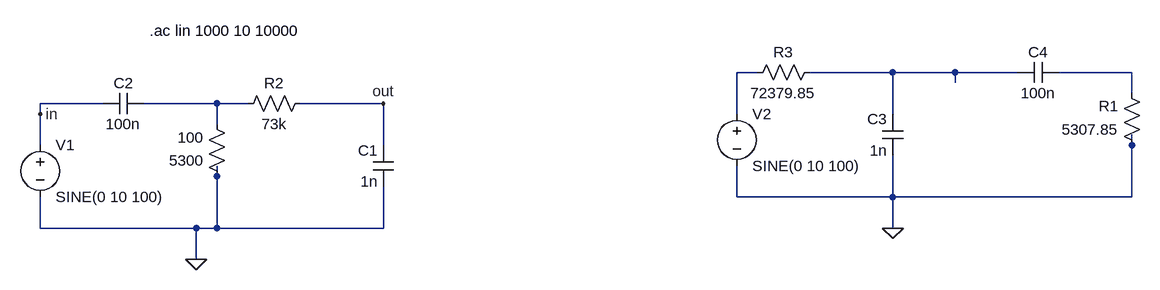
[diagram p0: schematic Passa-BandaRC.asc]
Passa-BandaRC.asc, the LTspice schematic file:
Version 4
SHEET 1 1508 680
WIRE 912 160 880 160
WIRE 1120 160 992 160
WIRE 1216 160 1120 160
WIRE 1312 160 1216 160
WIRE 1488 160 1376 160
WIRE 1216 176 1216 160
WIRE 1488 192 1488 160
WIRE -96 208 -192 208
WIRE 80 208 -32 208
WIRE 128 208 80 208
WIRE 336 208 208 208
WIRE -192 224 -192 208
WIRE 880 224 880 160
WIRE 1120 224 1120 160
WIRE 80 240 80 208
WIRE -192 272 -192 224
WIRE 336 272 336 208
WIRE 1488 272 1488 256
WIRE 80 320 80 304
WIRE 880 352 880 304
WIRE 1120 352 1120 288
WIRE 1120 352 880 352
WIRE 1488 352 1488 272
WIRE 1488 352 1120 352
WIRE -192 400 -192 352
WIRE 48 400 -192 400
WIRE 80 400 80 320
WIRE 80 400 48 400
WIRE 336 400 336 336
WIRE 336 400 80 400
WIRE 1120 400 1120 352
WIRE 48 448 48 400
FLAG 48 448 0
FLAG 336 208 out
FLAG -192 224 in
FLAG 1120 400 0
SYMBOL res 96 336 R180
WINDOW 0 36 76 Left 2
WINDOW 3 36 40 Left 2
SYMATTR InstName 100
SYMATTR Value 5300
SYMBOL res 112 224 R270
WINDOW 0 32 56 VTop 2
WINDOW 3 0 56 VBottom 2
SYMATTR InstName R2
SYMATTR Value 73k
SYMBOL cap 352 336 R180
WINDOW 0 24 56 Left 2
WINDOW 3 24 8 Left 2
SYMATTR InstName C1
SYMATTR Value 1n
SYMBOL cap -96 224 R270
WINDOW 0 32 32 VTop 2
WINDOW 3 0 32 VBottom 2
SYMATTR InstName C2
SYMATTR Value 100n
SYMBOL voltage -192 256 R0
SYMATTR InstName V1
SYMATTR Value SINE(0 10 100)
SYMATTR Value2 AC 10 0
SYMBOL res 1504 288 R180
WINDOW 0 36 76 Left 2
WINDOW 3 36 40 Left 2
SYMATTR InstName R1
SYMATTR Value 5307.85
SYMBOL res 896 176 R270
WINDOW 0 32 56 VTop 2
WINDOW 3 0 56 VBottom 2
SYMATTR InstName R3
SYMATTR Value 72379.85
SYMBOL cap 1136 288 R180
WINDOW 0 24 56 Left 2
WINDOW 3 24 8 Left 2
SYMATTR InstName C3
SYMATTR Value 1n
SYMBOL cap 1312 176 R270
WINDOW 0 32 32 VTop 2
WINDOW 3 0 32 VBottom 2
SYMATTR InstName C4
SYMATTR Value 100n
SYMBOL voltage 880 208 R0
SYMATTR InstName V2
SYMATTR Value SINE(0 10 100)
SYMATTR Value2 AC 10 0
TEXT -24 96 Left 2 !.ac lin 1000 10 10000

The netlist it stands for:
* Passa-BandaRC.asc
R§100 0 N004 5300
R2 N004 out 73k
C1 0 out 1n
C2 in N004 100n
V1 in 0 SINE(0 10 100) AC 10 0
R1 0 N003 5307.85
R3 N001 N002 72379.85
C3 0 N002 1n
C4 N002 N003 100n
V2 N001 0 SINE(0 10 100) AC 10 0
.ac lin 1000 10 10000
.backanno
.end